# Altium schematic sheet MainBoard_Connectors_Matt.SchDoc
size B
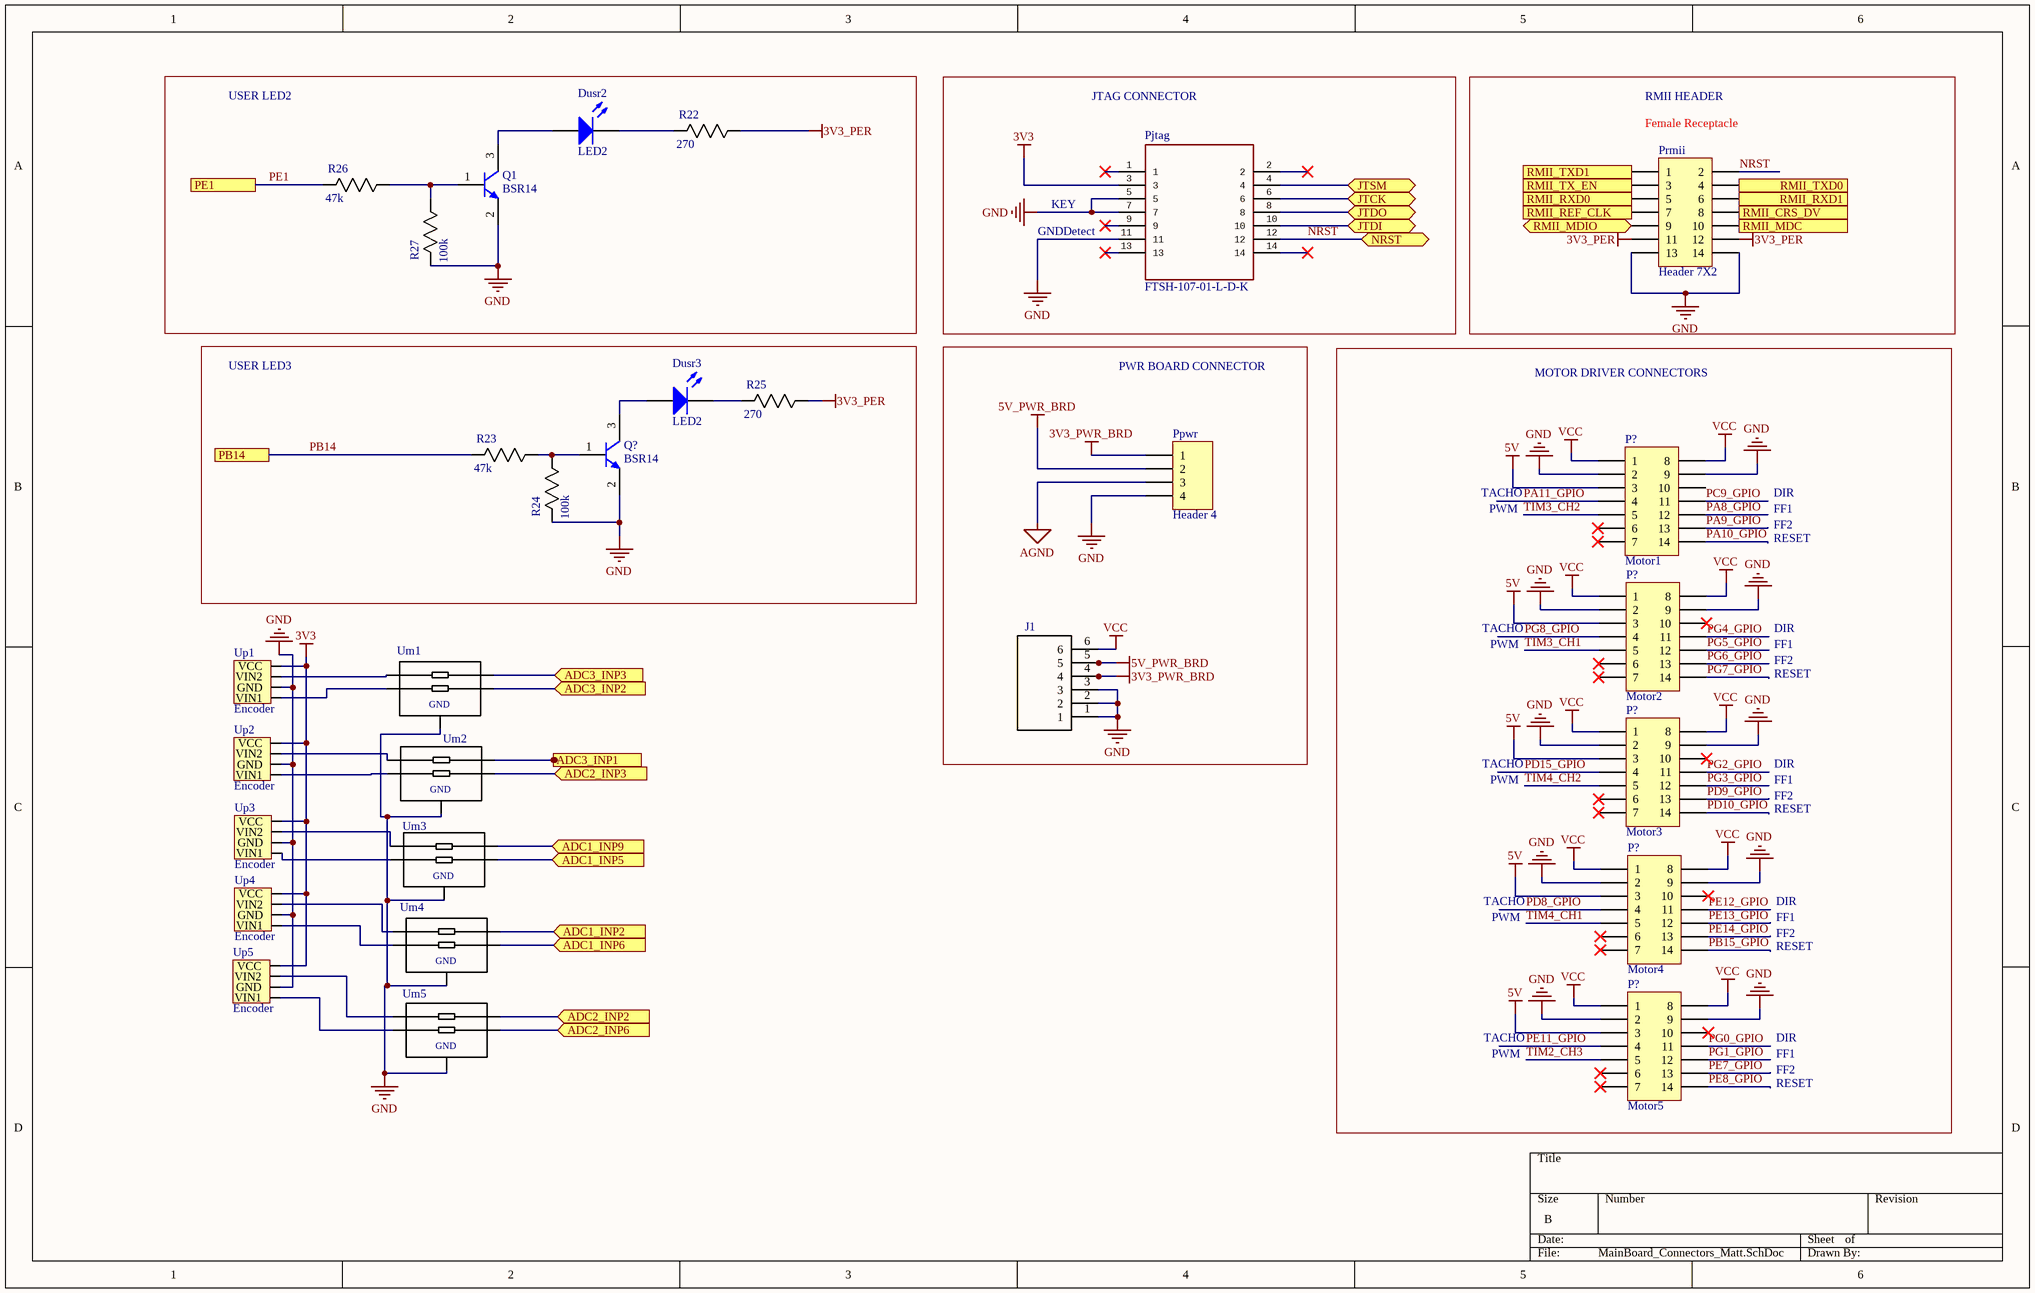
[diagram p0: MainBoard_Connectors_Matt.SchDoc]

## Parts
(Parts that share a designator on the sheet are numbered #1, #2 ... from top to bottom, then left to right.)
Dusr2  LED2  [3.2X1.6X1.1]
Dusr3  LED2  [3.2X1.6X1.1]
J1  CN HEADER VERT 6POS 3.96MM  [CN HDR 6POS 3.96MM]  (value not drawn)
P?#1  Motor1  [HDR2X7_CEN]
P?#2  Motor2  [HDR2X7_CEN]
P?#3  Motor3  [HDR2X7_CEN]
P?#4  Motor4  [HDR2X7_CEN]
P?#5  Motor5  [HDR2X7_CEN]
Pjtag  FTSH-107-01-L-D-K  [CN HDR JTAG]
Ppwr  Header 4  [HDR1X4]
Prmii  Header 7X2  [HDR2X7]
Q1  BSR14  [ONSC-SOT-23-3-318-08_V]
Q?  BSR14  [ONSC-SOT-23-3-318-08_V]
R22  270  [0805]
R23  47k  [0805]
R24  100k  [0805]
R25  270  [0805]
R26  47k  [0805]
R27  100k  [0805]
Um1  EMI  [SOT-665]  (value not drawn)
Um2  EMI  [SOT-665]  (value not drawn)
Um3  EMI  [SOT-665]  (value not drawn)
Um4  EMI  [SOT-665]  (value not drawn)
Um5  EMI  [SOT-665]  (value not drawn)
Up1  Encoder  [EncoderConnector]
Up2  Encoder  [EncoderConnector]
Up3  Encoder  [EncoderConnector]
Up4  Encoder  [EncoderConnector]
Up5  Encoder  [EncoderConnector]

## Blocks framed on the sheet
USER LED2: Dusr2 Q1 R22 R26 R27
USER LED3: Dusr3 Q? R23-R25
PWR BOARD CONNECTOR: J1 Ppwr

## Ports
ADC1_INP2 (in), ADC1_INP5 (in), ADC1_INP6 (in), ADC1_INP9 (in), ADC2_INP2 (in), ADC2_INP3 (in), ADC2_INP6 (in), ADC3_INP1 (in), ADC3_INP2 (in), ADC3_INP3 (in), JTCK (bidir), JTDI (bidir), JTDO (bidir), JTSM (bidir), NRST (bidir), PB14, PE1, RMII_CRS_DV (out), RMII_MDC (in), RMII_MDIO (bidir), RMII_REF_CLK (in), RMII_RXD0 (out), RMII_RXD1 (out), RMII_TX_EN (in), RMII_TXD0 (in), RMII_TXD1 (in)

## Nets
3V3: Pjtag.3 Up1.VCC Up2.VCC Up3.VCC Up4.VCC Up5.VCC
3V3_PER: Prmii.11 Prmii.12 R22.1(R1) R25.1(R1)
3V3_PWR_BRD: J1.4 Ppwr.1
5V: P?#1.3 P?#2.3 P?#3.3 P?#4.3 P?#5.3
5V_PWR_BRD: J1.5 Ppwr.2
AGND: Ppwr.3
GND: J1.1 J1.2 J1.3 P?#1.2 P?#1.9 P?#2.2 P?#2.9 P?#3.2 P?#3.9 P?#4.2 P?#4.9 P?#5.2 P?#5.9 Pjtag.5 Pjtag.7 Pjtag.11 Ppwr.4 Prmii.13 Prmii.14 Q1.2(E) Q?.2(E) R24.2(R2) R27.2(R2) Um1.2(P$2) Um2.2(P$2) Um3.2(P$2) Um4.2(P$2) Um5.2(P$2) Up1.GND Up2.GND Up3.GND Up4.GND Up5.GND
VCC: J1.6 P?#1.1 P?#1.8 P?#2.1 P?#2.8 P?#3.1 P?#3.8 P?#4.1 P?#4.8 P?#5.1 P?#5.8
ADC1_INP2: Um4.5(P$5) ; port ADC1_INP2
ADC1_INP5: Um3.4(P$4) ; port ADC1_INP5
ADC1_INP6: Um4.4(P$4) ; port ADC1_INP6
ADC1_INP9: Um3.5(P$5) ; port ADC1_INP9
ADC2_INP2: Um5.5(P$5) ; port ADC2_INP2
ADC2_INP3: Um2.4(P$4) ; port ADC2_INP3
ADC2_INP6: Um5.4(P$4) ; port ADC2_INP6
ADC3_INP1: Um2.5(P$5) ; port ADC3_INP1
ADC3_INP2: Um1.4(P$4) ; port ADC3_INP2
ADC3_INP3: Um1.5(P$5) ; port ADC3_INP3
JTCK: Pjtag.6 ; port JTCK
JTDI: Pjtag.10 ; port JTDI
JTDO: Pjtag.8 ; port JTDO
JTSM: Pjtag.4 ; port JTSM
NRST: Pjtag.12 Prmii.2 ; port NRST
PA8_GPIO: P?#1.12
PA9_GPIO: P?#1.13
PA10_GPIO: P?#1.14
PA11_GPIO: P?#1.4
PB14: R23.2(R2) ; port PB14
PB15_GPIO: P?#4.14
PC9_GPIO: P?#1.11
PD8_GPIO: P?#4.4
PD9_GPIO: P?#3.13
PD10_GPIO: P?#3.14
PD15_GPIO: P?#3.4
PE1: R26.2(R2) ; port PE1
PE7_GPIO: P?#5.13
PE8_GPIO: P?#5.14
PE11_GPIO: P?#5.4
PE12_GPIO: P?#4.11
PE13_GPIO: P?#4.12
PE14_GPIO: P?#4.13
PG0_GPIO: P?#5.11
PG1_GPIO: P?#5.12
PG2_GPIO: P?#3.11
PG3_GPIO: P?#3.12
PG4_GPIO: P?#2.11
PG5_GPIO: P?#2.12
PG6_GPIO: P?#2.13
PG7_GPIO: P?#2.14
PG8_GPIO: P?#2.4
RMII_CRS_DV: Prmii.8 ; port RMII_CRS_DV
RMII_MDC: Prmii.10 ; port RMII_MDC
RMII_MDIO: Prmii.9 ; port RMII_MDIO
RMII_REF_CLK: Prmii.7 ; port RMII_REF_CLK
RMII_RXD0: Prmii.5 ; port RMII_RXD0
RMII_RXD1: Prmii.6 ; port RMII_RXD1
RMII_TX_EN: Prmii.3 ; port RMII_TX_EN
RMII_TXD0: Prmii.4 ; port RMII_TXD0
RMII_TXD1: Prmii.1 ; port RMII_TXD1
TIM2_CH3: P?#5.5
TIM3_CH1: P?#2.5
TIM3_CH2: P?#1.5
TIM4_CH1: P?#4.5
TIM4_CH2: P?#3.5
NetDusr2_1: Dusr2.1(A) Q1.3(C)
NetDusr2_2: Dusr2.2(K) R22.2(R2)
NetDusr3_1: Dusr3.1(A) Q?.3(C)
NetDusr3_2: Dusr3.2(K) R25.2(R2)
NetQ1_1: Q1.1(B) R26.1(R1) R27.1(R1)
NetQ?_1: Q?.1(B) R23.1(R1) R24.1(R1)
NetUm1_1: Um1.1(P$1) Up1.VIN2
NetUm1_3: Um1.3(P$3) Up1.VIN1
NetUm2_1: Um2.1(P$1) Up2.VIN2
NetUm2_3: Um2.3(P$3) Up2.VIN1
NetUm3_1: Um3.1(P$1) Up3.VIN2
NetUm3_3: Um3.3(P$3) Up3.VIN1
NetUm4_1: Um4.1(P$1) Up4.VIN2
NetUm4_3: Um4.3(P$3) Up4.VIN1
NetUm5_1: Um5.1(P$1) Up5.VIN2
NetUm5_3: Um5.3(P$3) Up5.VIN1

Not connected (* = marked no-connect by the designer): P?#1 6* 7* 10; P?#2 6* 7* 10*; P?#3 6* 7* 10*; P?#4 6* 7* 10*; P?#5 6* 7* 10*; Pjtag 1* 2* 9* 13* 14*

## Notes on the sheet
- JTAG CONNECTOR
- RMII HEADER
- (near Prmii) Female Receptacle
- (near Pjtag) GNDDetect
- KEY
- MOTOR DRIVER CONNECTORS
- TACHO
- DIR
- PWM
- FF1
- FF2
- RESET
- (in symbol IP4256CZ5-W) GND

## Library data of the parts
Dusr2 = LED GREEN SMD: Typical RED, GREEN, YELLOW, AMBER GaAs LED; MF: Lite-On Inc.; MP: LTST-C191KGKT; Rating: 2V; Digikey: 160-1446-1-ND; Digikey Link: https://www.digikey.ca/products/en?keywords=160-1446-1-ND; Package: 0603
Dusr3 = LED RED SMD: Typical RED, GREEN, YELLOW, AMBER GaAs LED; MF: Lite-On Inc.; MP: LTST-C190CKT; Rating: 1.8V; Digikey: 160-1181-1-ND; Digikey Link: https://www.digikey.ca/products/en?keywords=160-1181-1-ND; Package: 0603
J1 = CN HDR VERT 6POS 3.96MM: Connector Header Through Hole 6 position 0.156" (3.96mm); MF: TE Connectivity; MP: 1877285-6; Current Rating: 7.5A; Voltage Rating: 250VAC; SnapEDA_Link: https://www.snapeda.com/parts/1877285-6/TE%20Connectivity/view-part/2371244/?ref=snap; Digikey: A99849-ND; Digikey Link: https://www.digikey.ca/product-detail/en/te-connectivity-amp-connectors/1877285-6/A99849-ND/2000097
P?#1-P?#5 = Header 7X2A: Header, 7-Pin, Dual row; LatestRevisionDate: 17-Jul-2002; LatestRevisionNote: Re-released for DXP Platform.; Publisher: Altium Limited
Pjtag = CN HDR JTAG: Connector Header Through Hole 14 position 0.050" (1.27mm); MF: Samtec Inc.; Rating: 3.4A; ComponentLink1Description: Digikey; ComponentLink1URL: https://www.digikey.ca/product-detail/en/samtec-inc/FTSH-107-01-L-D-K/612-FTSH-107-01-L-D-K-ND/6693516; ComponentLink2Description: Datasheet; ComponentLink2URL: https://www.digikey.ca/en/datasheets/samtecinc/samtec-inc-ftsh-1xx-xx-xx-d-xx-xx-mkt; Digikey: 612-FTSH-107-01-L-D-K-ND; Digikey Link: https://www.digikey.ca/product-detail/en/samtec-inc/FTSH-107-01-L-D-K/612-FTSH-107-01-L-D-K-ND/6693516; MP: FTSH-107-01-L-D-K; Price: 5.14000 CAD
Ppwr = Header 4: Header, 4-Pin; LatestRevisionDate: 17-Jul-2002; LatestRevisionNote: Re-released for DXP Platform.; Publisher: Altium Limited
Prmii = Header 7X2: Header, 7-Pin, Dual row; LatestRevisionDate: 17-Jul-2002; LatestRevisionNote: Re-released for DXP Platform.; Publisher: Altium Limited
Q1 Q? = CMP-1048-00605-1: Bipolar (BJT) Transistor NPN 40V 800mA 300MHz 350mW Surface Mount SOT-23-3; ComponentLink1Description: Manufacturer URL; ComponentLink3Description: Package Specification; ComponentLink2URL: http://www.onsemi.com/pub_link/Collateral/BSS64LT1-D.PDF; ComponentLink1URL: http://www.onsemi.com/; ComponentLink2Description: Datasheet; ComponentLink3URL: http://www.onsemi.cn/pub_link/Collateral/318-08.PDF; Digikey: BSR14TR-ND
R22 R25 = RES 270 0805: RES SMD 270 OHM 5% 1/8W 0805; MP: RC0805JR-07270RL; MF: Yageo; Rating: 0.125W; Digikey: 311-270ARCT-ND; Price: 0.054 CAD; Package: 0805; Value: 270; Digikey Link: https://www.digikey.ca/product-detail/en/yageo/RC0805JR-07270RL/311-270ARCT-ND/731238
R23 R26 = RES 47k 0805: RES SMD 47K OHM 1% 1/8W 0805; MP: RC0805FR-0747KL; MF: Yageo; Rating: 0.125W; Digikey: 311-47.0KCRCT-ND; Price: 0.061 CAD; Package: 0805; Value: 47k; Digikey Link: https://www.digikey.ca/product-detail/en/yageo/RC0805FR-0747KL/311-47.0KCRCT-ND/730920; Tolerance: 1%
R24 R27 = RES 100k 0805: RES SMD 100K OHM 1% 1/8W 0805; MP: RC0805FR-07100KL; MF: Yageo; Rating: 0.125W; Digikey: 311-100KCRCT-ND; Price: 0.058 CAD; Package: 0805; Value: 100k; Digikey Link: https://www.digikey.ca/products/en?keywords=311-100KCRCT-ND; Tolerance: 1%
Um1-Um5 = IP4256CZ5-W: RC (Pi) EMI Filter 2nd Order Low Pass 2 Channel R = 100Ohms, C = 19pF (Total)  SOT-665; MF: Nexperia USA Inc.; MP: IP4256CZ5-W,115; SnapEDA_Link: https://www.snapeda.com/parts/IP4256CZ5-W/Nexperia%20USA%20Inc./view-part/3605439/?ref=snap; Price: 0.17 CAD; Package: SOT-665; Digikey: 1727-4718-1-ND; Digikey Link: https://www.digikey.ca/product-detail/en/nexperia-usa-inc/IP4256CZ5-W115/1727-4718-1-ND/2531158
Up1-Up5 = Encoder Connector: CONN HEADER R/A 4POS 1.5MM; MF: JST Sales America Inc.; MP: S4B-ZR(LF)(SN); Rating: 1A; Digikey: 455-1671-ND; Digikey Link: https://www.digikey.ca/products/en?keywords=455-1671-ND; Price: 0.324 CAD; Package: N/A; Value: N/A